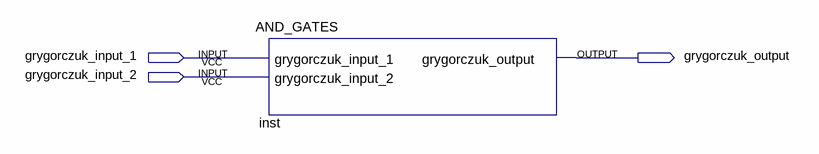
[diagram p0: schematic sheet]
// Quartus schematic AND_SYMBOL.bdf as structural Verilog: 1 symbols, 3 pins
module AND_SYMBOL (
  input  grygorczuk_input_1,
  input  grygorczuk_input_2,
  output grygorczuk_output
);

  AND_GATES inst (
    .grygorczuk_input_1(grygorczuk_input_1), .grygorczuk_input_2(grygorczuk_input_2),
    .grygorczuk_output(grygorczuk_output));
endmodule
